# EAGLE design IO-Linky6362_rev1.0 (EAGLE 9.7.0)
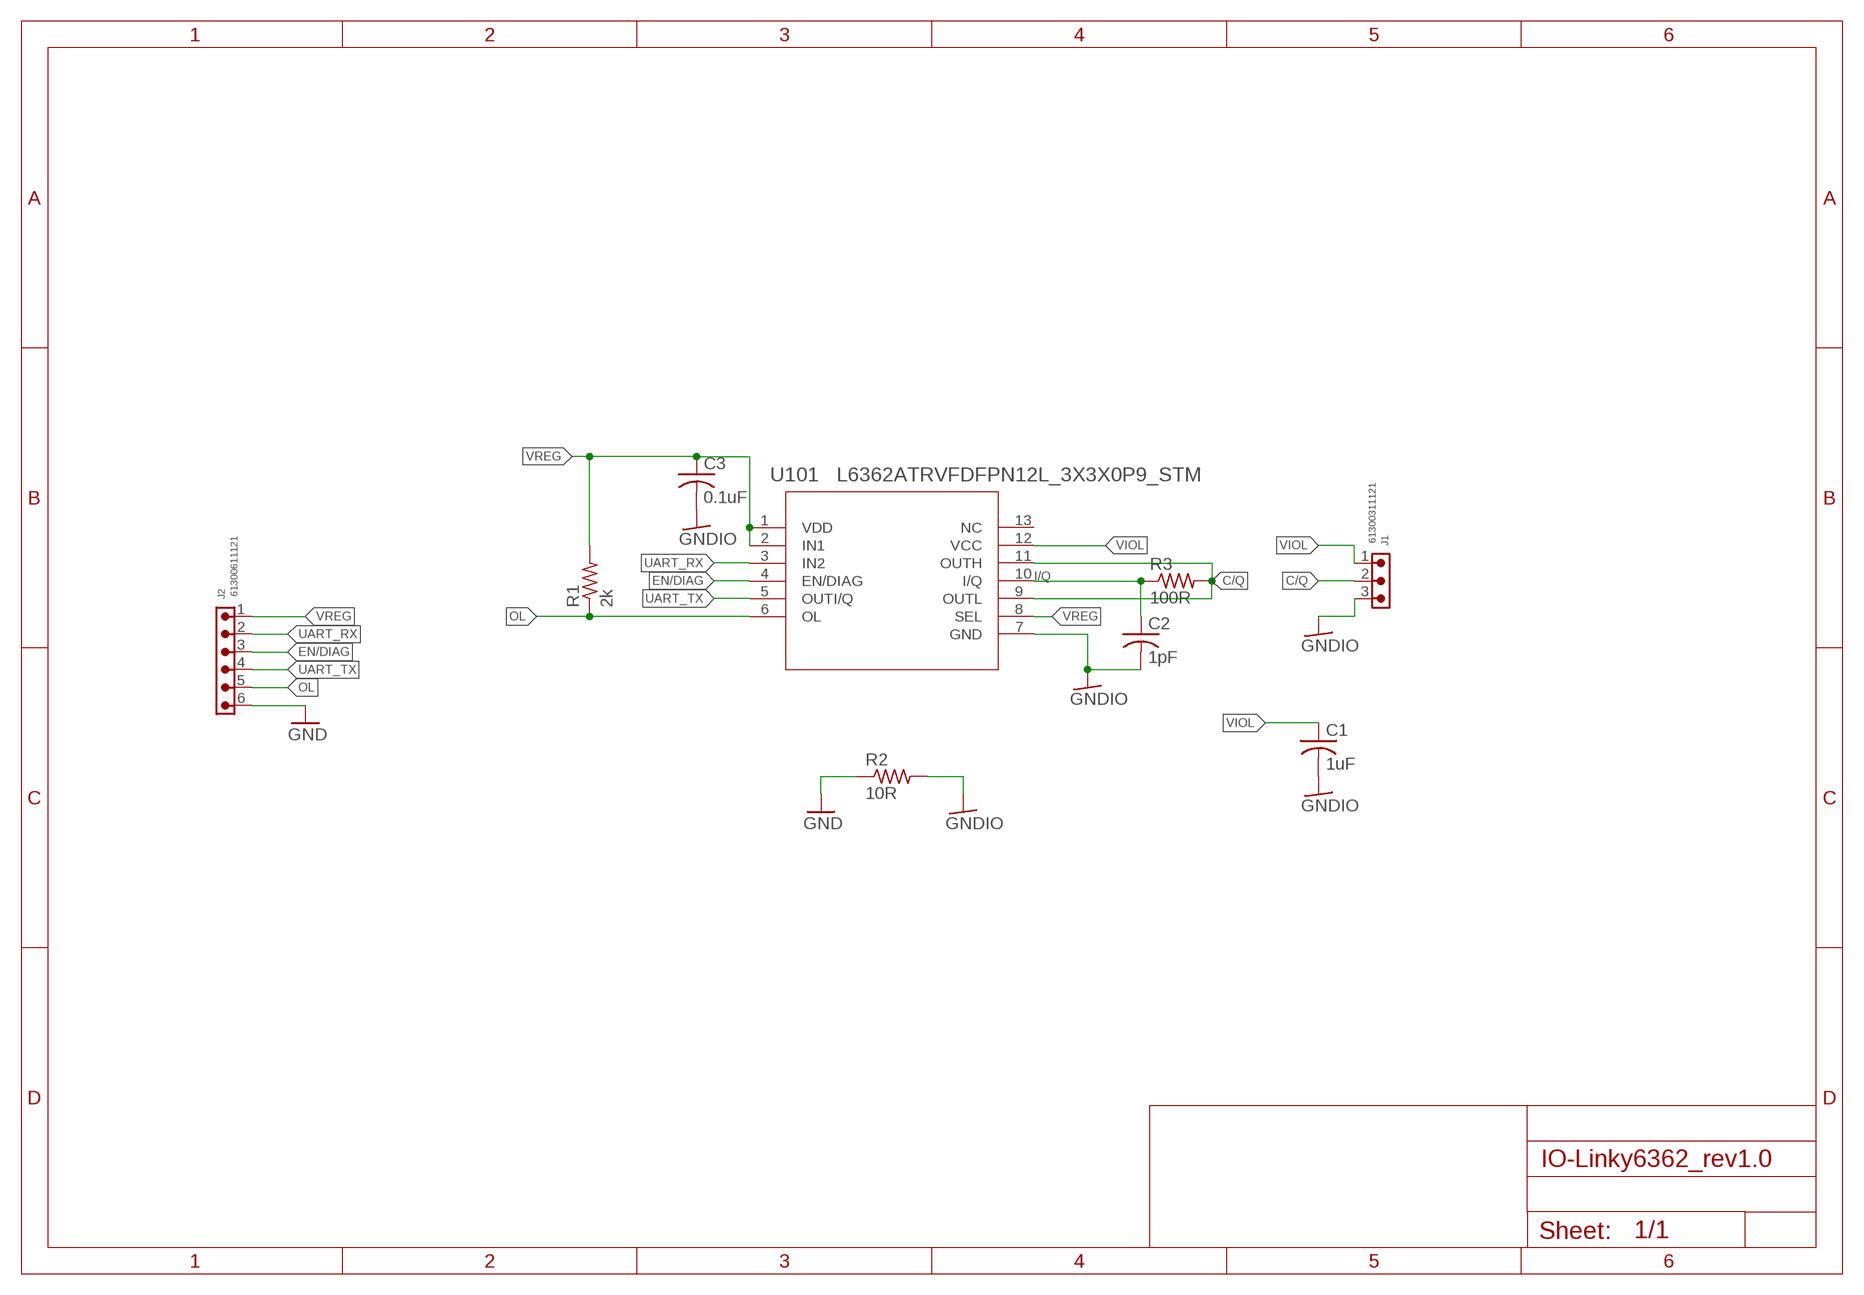
[diagram p0: schematic, sheet 1]

## Parts
C1  1uF  C-USC0603K  [C0603K]
C2  1pF  C-USC0603K  [C0603K]
C3  0.1uF  C-USC0603K  [C0603K]
J1  61300311121  6130XX11121_61300311121  [61300311121]
J2  61300611121  6130XX11121_61300611121  [61300611121]
R1  2k  R-US_R0603  [R0603]
R2  10R  R-US_R0603  [R0603]
R3  100R  R-US_R0603  [R0603]
U101  L6362ATRVFDFPN12L_3X3X0P9_STM  [VFDFPN12L_3X3X0P9_STM]

## Nets
C/Q: J1.2 R3.2 U101.9(OUTL) U101.11(OUTH)
EN/DIAG: J2.3 U101.4(EN/DIAG)
GND: J2.6 R2.1
GNDIO: C1.2 C2.2 C3.2 J1.3 R2.2 U101.7(GND)
I/Q: C2.1 R3.1 U101.10(I/Q)
OL: J2.5 R1.1 U101.6(OL)
UART_RX: J2.2 U101.3(IN2)
UART_TX: J2.4 U101.5(OUTI/Q)
VIOL: C1.1 J1.1 U101.12(VCC)
VREG: C3.1 J2.1 R1.2 U101.1(VDD) U101.2(IN1) U101.8(SEL)
Unconnected: U101.13(NC)

## Library data of the parts
C1-C3 = adafruit:C-US: CAPACITOR, American symbol
J1 = Wurth_Connectors_WR-PHD:6130XX11121_61300311121: WR-PHD 2.54 mm THT Pin Header ARTICLE PROPERTIES: Pins:1;​ 2;​ 3;​ 4;​ 5;​ 6;​ 7;​ 8;​ 9;​ 10;​ 12;​ 13;​ 14;​ 15;​ 16;​ 18;​ 20;​ 22;​ 24;​ 25;​ 32;​ 36;​ 40 KIND PROPERTIES: Pitch：2.54 mm Quality Class:3 as per CECC 75 301-802 Rows：Single Gender：Pin Header Type：Straight MATERIAL PROPERTIES: Insulator Material :PBT Insulator Flammability Rating:UL94 V-0 Contact Material:Copper Alloy Contact Plating:Gold Contact Type:Stamped GENERAL INFORMATION Operating Temperature:-40 up to +105 °C Compliance:RoHS ELECTRICAL PROPERTIES: Rated Current:3 A IR 1:3 A Withstanding Voltage:500 V (AC) Contact Resistance:20 mΩ RISO:1000 MΩ CERTIFICATION UL Approval:E323964 PACKAGING PROPERTIES Packaging:Bag <https://katalog.we-online.com/media/images/v2/o33211v209%20Family_BTB_PHD_6130xx11121.jpg> Details see: https://katalog.we-online.com/en/em/PHD_2_54_THT_PIN_HEADER_6130XX11121 Updated by Yingchun,Shan 2019-10-16 2019 (C) Würth Elektronik; DATASHEET-URL: https://www.we-online.com/catalog/datasheet/61300311121.pdf; GENDER: Pin Header; IR: 3A; MOUNT: THT; PACKAGING: Bag; PART-NUMBER: 61300311121; PINS: 3; PITCH: 2.54mm; ROWS: Single; TYPE: Straight
J2 = Wurth_Connectors_WR-PHD:6130XX11121_61300611121: WR-PHD 2.54 mm THT Pin Header ARTICLE PROPERTIES: Pins:1;​ 2;​ 3;​ 4;​ 5;​ 6;​ 7;​ 8;​ 9;​ 10;​ 12;​ 13;​ 14;​ 15;​ 16;​ 18;​ 20;​ 22;​ 24;​ 25;​ 32;​ 36;​ 40 KIND PROPERTIES: Pitch：2.54 mm Quality Class:3 as per CECC 75 301-802 Rows：Single Gender：Pin Header Type：Straight MATERIAL PROPERTIES: Insulator Material :PBT Insulator Flammability Rating:UL94 V-0 Contact Material:Copper Alloy Contact Plating:Gold Contact Type:Stamped GENERAL INFORMATION Operating Temperature:-40 up to +105 °C Compliance:RoHS ELECTRICAL PROPERTIES: Rated Current:3 A IR 1:3 A Withstanding Voltage:500 V (AC) Contact Resistance:20 mΩ RISO:1000 MΩ CERTIFICATION UL Approval:E323964 PACKAGING PROPERTIES Packaging:Bag <https://katalog.we-online.com/media/images/v2/o33211v209%20Family_BTB_PHD_6130xx11121.jpg> Details see: https://katalog.we-online.com/en/em/PHD_2_54_THT_PIN_HEADER_6130XX11121 Updated by Yingchun,Shan 2019-10-16 2019 (C) Würth Elektronik; DATASHEET-URL: https://www.we-online.com/catalog/datasheet/61300611121.pdf; GENDER: Pin Header; IR: 3A; MOUNT: THT; PACKAGING: Bag; PART-NUMBER: 61300611121; PINS: 6; PITCH: 2.54mm; ROWS: Single; TYPE: Straight
R1-R3 = adafruit:R-US_: RESISTOR, American symbol
U101 = L6362A:L6362ATR; COPYRIGHT: Copyright (C) 2024 Ultra Librarian. All rights reserved.; MANUFACTURER_PART_NUMBER: L6362ATR; MFR_NAME: STMicroelectronics

## Board
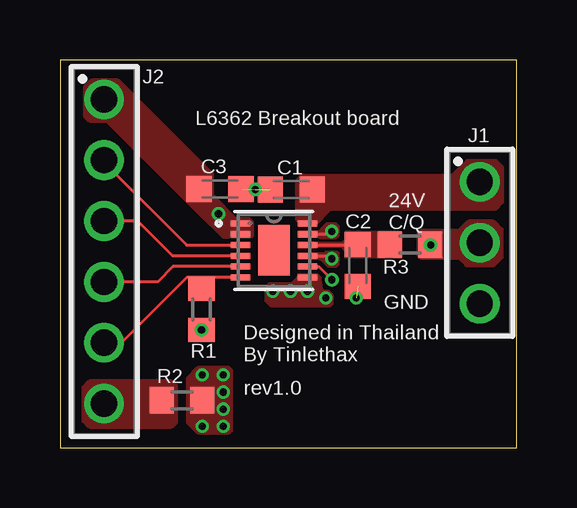
[diagram p1: board, top side]
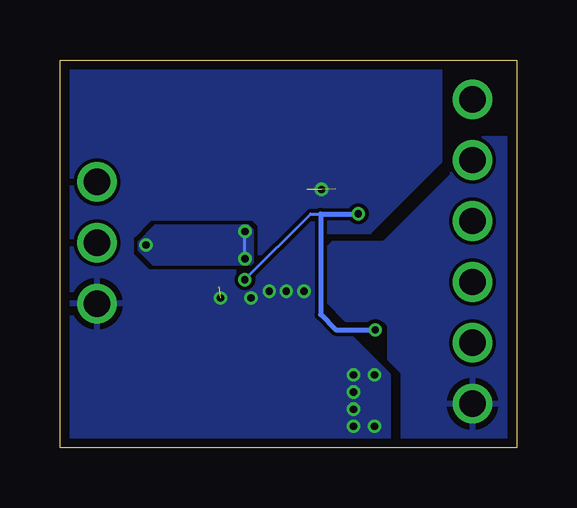
[diagram p2: board, bottom side, seen from below]

Size 19.03 x 16.18 mm. Coordinates in mm from the lower left corner, seen from the top.
Outline: 0,0 19.03,0 19.03,16.18 0,16.18 0,0
Copper layers (1*16): Top 0.035559375mm / dielectric 1.6mm / Bottom 0.035559375mm
Design rules "oshpark-2layer": minimum track width 6mil, minimum drill 10mil, track to track 6mil, track to pad 6mil, pad to pad 6mil, via to via 6mil, smd to smd 6mil, copper to edge 15mil, drill to drill 6mil, minimum pad ring 5mil, minimum via ring 5mil, stop-mask expansion 2.5mil, vias tented up to drill 0mil, thermal gap 10mil

### Footprints (pad centres in the part's own frame; a part is rotated, then mirrored left to right if it is on the bottom)
C0603K = smd 1.05 x 1.08: 1 -0.875,0; 2 0.875,0
61300311121 = drill 1.1: 1 -2.54,0; 2 0,0; 3 2.54,0
61300611121 = drill 1.1: 1 -6.35,0; 2 -3.81,0; 3 -1.27,0; 4 1.27,0; 5 3.81,0; 6 6.35,0
R0603 = smd 1 x 1.1: 1 -0.85,0; 2 0.85,0
VFDFPN12L_3X3X0P9_STM = smd 0.813 x 0.254: 1 -1.397,1.125; 2 -1.397,0.675; 3 -1.397,0.225; 4 -1.397,-0.225; 5 -1.397,-0.675; 6 -1.397,-1.125; 7 1.397,-1.125; 8 1.397,-0.675; 9 1.397,-0.225; 10 1.397,0.225; 11 1.397,0.675; 12 1.397,1.125 | smd 1.321 x 2.108: 13 0,0

### Placement (x,y rotation side)
C1  9.63,10.78 180 top
C2  12.41,7.6 270 top
C3  6.67,10.79 0 top
J1  17.49,8.55 270 top
J2  1.84,8.19 270 top
R1  5.9,5.77 270 top
R2  5.08,1.98 0 top
R3  14.58,8.48 0 top
U101  8.92,8.24 0 top

### Tracks (layer width: path | path; a pad name or v marks a point on that pad's centre or on a via)
C/Q  (via drill 0.3)
  Top 0.127: U101.11 11.2,8.91 v11.32,9.03 | U101.9 11.2,8.01 v11.32,7.89
  Bottom 0.127: v11.32,7.89 v11.32,9.03
  other vias: 15.44,8.46
  pour Top (no thermals): 9.97,9.01 9.97,8.83 10.71,8.83 10.73,8.82 10.77,8.78 11.51,8.78 11.6,8.87 11.6,9.25 11.51,9.34 11.1,9.34 10.78,9.02 10.76,9.01
  pour Top (no thermals): 9.97,8.1 9.97,7.89 10.83,7.89 10.86,7.88 11.15,7.59 11.53,7.59 11.6,7.65 11.6,8.11 11.56,8.15 11.05,8.15 11.01,8.11 10.99,8.1
  pour Bottom: 11.1,7.64 15.14,7.64 15.74,8.24 15.74,8.59 15.06,9.26 11.18,9.26 11.01,9.1 11.01,7.73
  pour Top (no thermals): 14.97,8.07 15.05,7.99 16.61,7.99 16.66,7.97 16.96,7.67 18.04,7.67 18.37,7.99 18.37,9.08 18.04,9.4 17.04,9.4 16.66,9.02 16.61,9 15.05,9 14.97,8.92
EN/DIAG
  Top 0.127: U101.4 4.69,8.01 3.24,9.46 J2.3
GND
  pour Top (rank 6, no thermals): 1.24,0.92 4.63,0.92 4.79,1.08 4.79,2.57 4.63,2.73 1.24,2.73 1,2.49 1,1.16
  pour Bottom (rank 6): 5.54,8.59 5.52,8.6 2.72,11.39 2.71,11.42 2.71,12.44 2.2,12.95 0.06,12.95 0.06,0.06 4.78,0.06 4.78,3.11 4.79,3.13 5.33,3.68 5.33,5.09 5.34,5.12 5.52,5.29 5.54,5.3 7.12,5.3 7.87,6.06 7.87,8.39 7.67,8.59
GNDIO  (via drill 0.3)  (3 unrouted)
  other vias: 10.31,6.53 9.6,6.53 8.86,6.53 11.07,6.25 12.34,6.25 8.14,10.78 5.93,3.04 6.8,3.04 6.8,2.33 6.8,1.61 5.93,0.9 6.8,0.9
  pour Top (rank 6, no thermals): 9.91,7.11 9.63,6.84 9.61,6.83 8.69,6.83 8.57,6.71 8.57,6.13 8.76,5.94 11.28,5.94 11.34,6 11.34,6.38 11.2,6.52 11.04,6.52 11.01,6.53 10.89,6.65 10.88,6.67 10.88,7.07 10.69,7.26 9.96,7.26 9.92,7.22 9.92,7.14
  pour Top (rank 6, no thermals): 5.77,0.68 7.01,0.68 7.1,0.77 7.1,3.2 7.01,3.29 5.77,3.29 5.37,2.88 5.37,1.08
  pour Bottom (rank 6): 8.22,5.93 8.2,5.88 5.37,3.04 5.37,0.13 18.92,0.13 18.92,16.07 3.22,16.07 3.22,11.96 6.16,9.02 7.88,9.02 7.93,9 8.2,8.72 8.22,8.68
I/Q
  Top 0.127: U101.10 12.39,8.46 C2.1
  pour Top (no thermals): 10.6,8.39 11.73,8.39 11.89,8.23 11.89,7.96 14.2,7.96 14.22,7.98 14.22,8.98 14.2,9 11.91,9 11.89,8.98 11.89,8.7 11.73,8.54 10.6,8.54 10.57,8.57 9.96,8.57 9.96,8.36 10.57,8.36
OL
  Top 0.127: U101.6 5.87,7.11 | 5.87,7.11 5.29,7.11 2.56,4.38 J2.5 | R1.1 5.9,7.09 5.87,7.11
UART_RX
  Top 0.127: J2.2 1.84,11.89 5.27,8.46 U101.3
UART_TX
  Top 0.127: U101.5 4.7,7.56 4.06,6.92 J2.4
VIOL
  pour Top (no thermals): 16.96,11.98 16.33,11.36 16.31,11.35 10.05,11.35 9.85,11.15 9.85,9.53 10.08,9.3 10.64,9.3 11.29,9.96 11.31,9.97 18.18,9.97 18.46,10.25 18.46,11.7 18.18,11.98
VREG  (via drill 0.3)
  Top 0.127: U101.8 10.78,7.56 v11.33,7.02
  Bottom 0.127: v11.33,7.02 8.59,9.76 8.18,9.76 | R1.2
  Bottom 0.203: v6.6,9.76 8.18,9.76 8.18,5.56 7.54,4.92 R1.2
  other vias: 5.9,4.92
  pour Top (no thermals): 7.37,9.54 7.35,9.55 6.38,10.52 6.37,10.54 6.37,11.24 6.24,11.37 5.34,11.37 5.22,11.24 5.22,10.35 6.77,8.79 7.99,8.79 8.03,8.84 8.03,9.42 7.91,9.54
  pour Top (rank 6, no thermals): 1.08,13.86 1.24,13.7 1.93,13.7 1.98,13.68 5.37,10.29 6.22,10.29 6.3,10.37 6.3,11.38 2.41,15.27 1.32,15.27 1.08,15.03

### Text on the board
tPlace: L6362 Breakout board | 24V / C/Q | GND | Designed in Thailand / By Tinlethax | rev1.0